# Altium schematic sheet PowerDriver.SchDoc
size A4
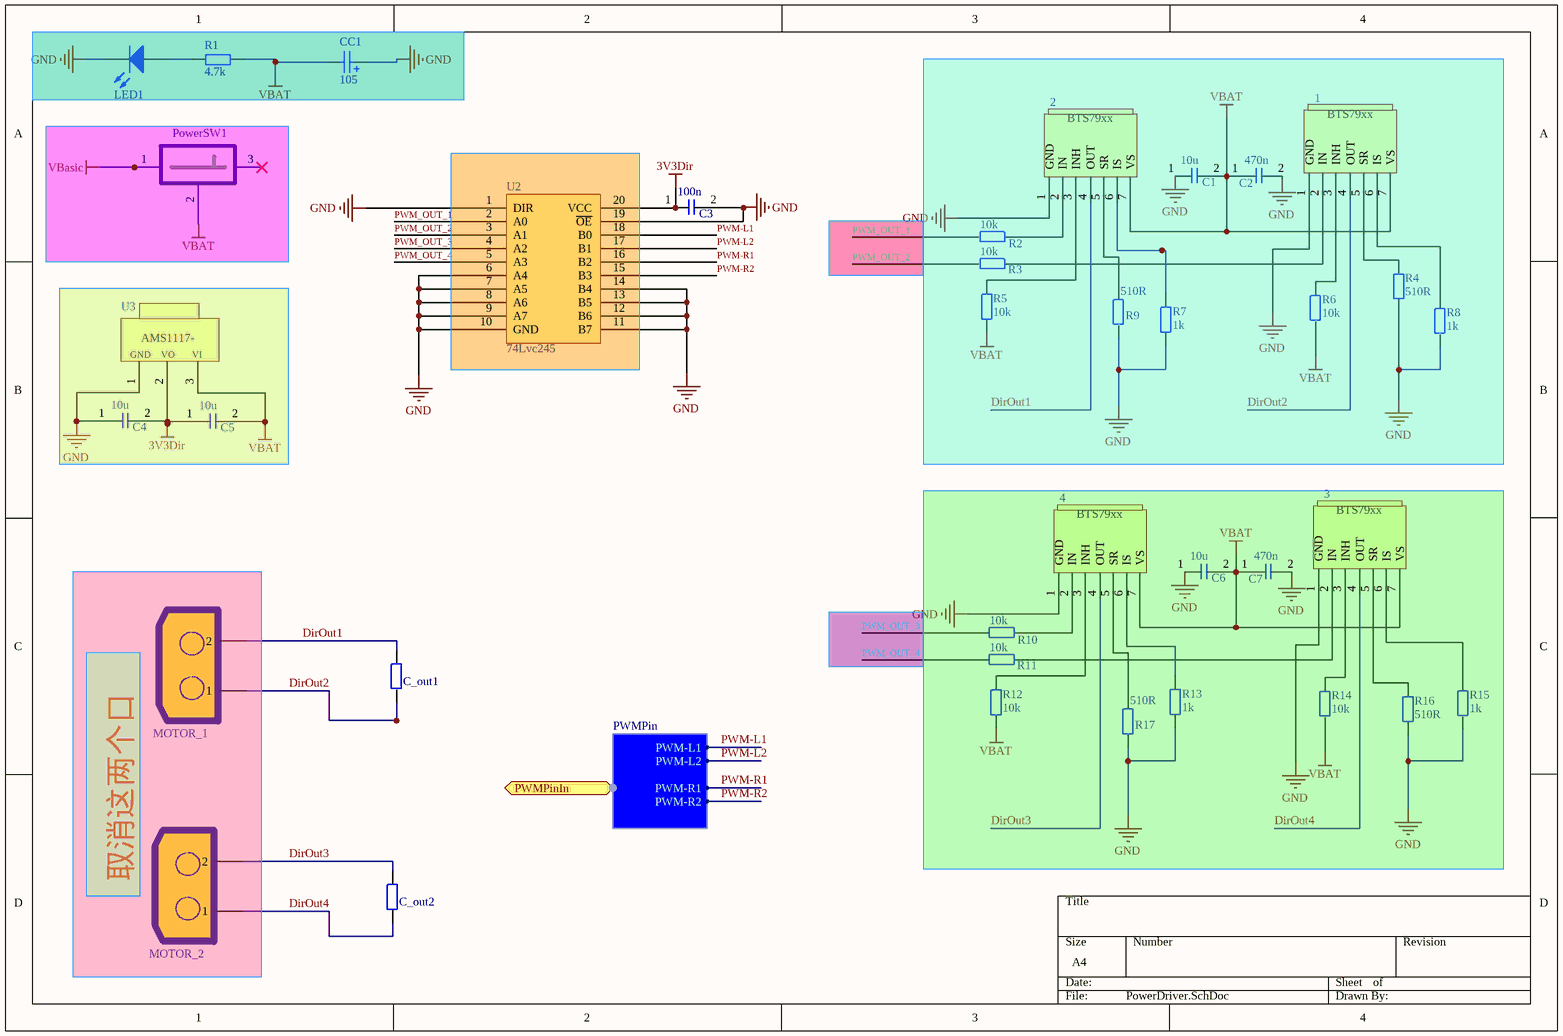
[diagram p0: PowerDriver.SchDoc]

## Parts
1  BTS79xx  [BTS79xx]  (value not drawn)
2  BTS79xx  [BTS79xx]  (value not drawn)
3  BTS79xx  [BTS79xx]  (value not drawn)
4  BTS79xx  [BTS79xx]  (value not drawn)
C1  10u  [0805电容]
C2  470n  [0805电容]
C3  100n  [0805电容]
C4  10u  [0805电容]
C5  10u  [0805电容]
C6  10u  [0805电容]
C7  470n  [0805电容]
C_out1  0  [0805电阻]  (value not drawn)
C_out2  0  [0805电阻]  (value not drawn)
CC1  Capacitance: 105  [CAPMP6032X26N]  (hidden comment: Cap Tan C)
LED1  0805LED  [0805LED]  (value not drawn)
MOTOR_1  P  [2脚接头]  (value not drawn)
MOTOR_2  P  [2脚接头]  (value not drawn)
PowerSW1  Power  [PowerSW]  (value not drawn)
R1  4.7k  [0805电阻]
R2  10k  [0805电阻]
R3  10k  [0805电阻]
R4  510R  [0805电阻]
R5  10k  [0805电阻]
R6  10k  [0805电阻]
R7  1k  [0805电阻]
R8  1k  [0805电阻]
R9  510R  [0805电阻]
R10  10k  [0805电阻]
R11  10k  [0805电阻]
R12  10k  [0805电阻]
R13  1k  [0805电阻]
R14  10k  [0805电阻]
R15  1k  [0805电阻]
R16  510R  [0805电阻]
R17  510R  [0805电阻]
U2  74Lvc245  [TSOP65P650X110-20N]
U3  AMS1117-  [AMS1117-]  (value not drawn)

## Blocks framed on the sheet
取消这两个口: MOTOR_1 MOTOR_2

## Ports
PWMPinIn (harness PWMPin)

## Harnesses
PWMPin: PWM-L1, PWM-L2, PWM-R1, PWM-R2

## Nets
3V3Dir: C3.1 C4.2 C5.1 U2.20(VCC) U3.2(Vout)
GND: 1.1(GND) 2.1(GND) 3.1(GND) 4.1(GND) C1.1 C2.2 C3.2 C4.1 C6.1 C7.2 CC1.2 LED1.2(K) R4.1 R7.1 R8.1 R9.1 R13.1 R15.1 R16.1 R17.1 U2.1(DIR) U2.6(A4) U2.7(A5) U2.8(A6) U2.9(A7) U2.10(GND) U2.11(B7) U2.12(B6) U2.13(B5) U2.14(B4) U2.19(~{OE}) U3.1(GND)
VBasic: PowerSW1.1
VBAT: 1.7(VS) 2.7(VS) 3.7(VS) 4.7(VS) C1.2 C2.1 C5.2 C6.2 C7.1 CC1.1 PowerSW1.2 R1.1 R5.1 R6.1 R12.1 R14.1 U3.3(Vin)
DirOut1: 2.4(OUT) C_out1.2 MOTOR_1.2
DirOut2: 1.4(OUT) C_out1.1 MOTOR_1.1
DirOut3: 4.4(OUT) C_out2.2 MOTOR_2.2
DirOut4: 3.4(OUT) C_out2.1 MOTOR_2.1
PWM-L1: U2.18(B0) ; port PWMPinIn.PWM-L1
PWM-L2: U2.17(B1) ; port PWMPinIn.PWM-L2
PWM-R1: U2.16(B2) ; port PWMPinIn.PWM-R1
PWM-R2: U2.15(B3) ; port PWMPinIn.PWM-R2
PWM_OUT_1: R2.1 U2.2(A0)
PWM_OUT_2: R3.1 U2.3(A1)
PWM_OUT_3: R10.1 U2.4(A2)
PWM_OUT_4: R11.1 U2.5(A3)
Net1_2: 1.2(IN) R3.2
Net1_3: 1.3(INH) R6.2
Net1_5: 1.5(SR) R4.2
Net1_6: 1.6(IS) R8.2
Net2_2: 2.2(IN) R2.2
Net2_3: 2.3(INH) R5.2
Net2_5: 2.5(SR) R9.2
Net2_6: 2.6(IS) R7.2
Net3_2: 3.2(IN) R11.2
Net3_3: 3.3(INH) R14.2
Net3_5: 3.5(SR) R16.2
Net3_6: 3.6(IS) R15.2
Net4_2: 4.2(IN) R10.2
Net4_3: 4.3(INH) R12.2
Net4_5: 4.5(SR) R17.2
Net4_6: 4.6(IS) R13.2
NetLED1_1: LED1.1(A) R1.2

Not connected (* = marked no-connect by the designer): PowerSW1 3*

## Notes on the sheet
- (in symbol AMS1117-) VO; VI

## Library data of the parts
C1-C7 = 0805电容
C_out1 C_out2 R1-R17 = 0805电阻
CC1 = Cap Tan C: Polarized Capacitor (Radial); Voltage: 16V; Published: 8-Jun-2000; Revision: July-2002: Re-released for DXP Platform.; Publisher: Altium Limited
MOTOR_1 MOTOR_2 = 2脚接头
PowerSW1 = PowerSW